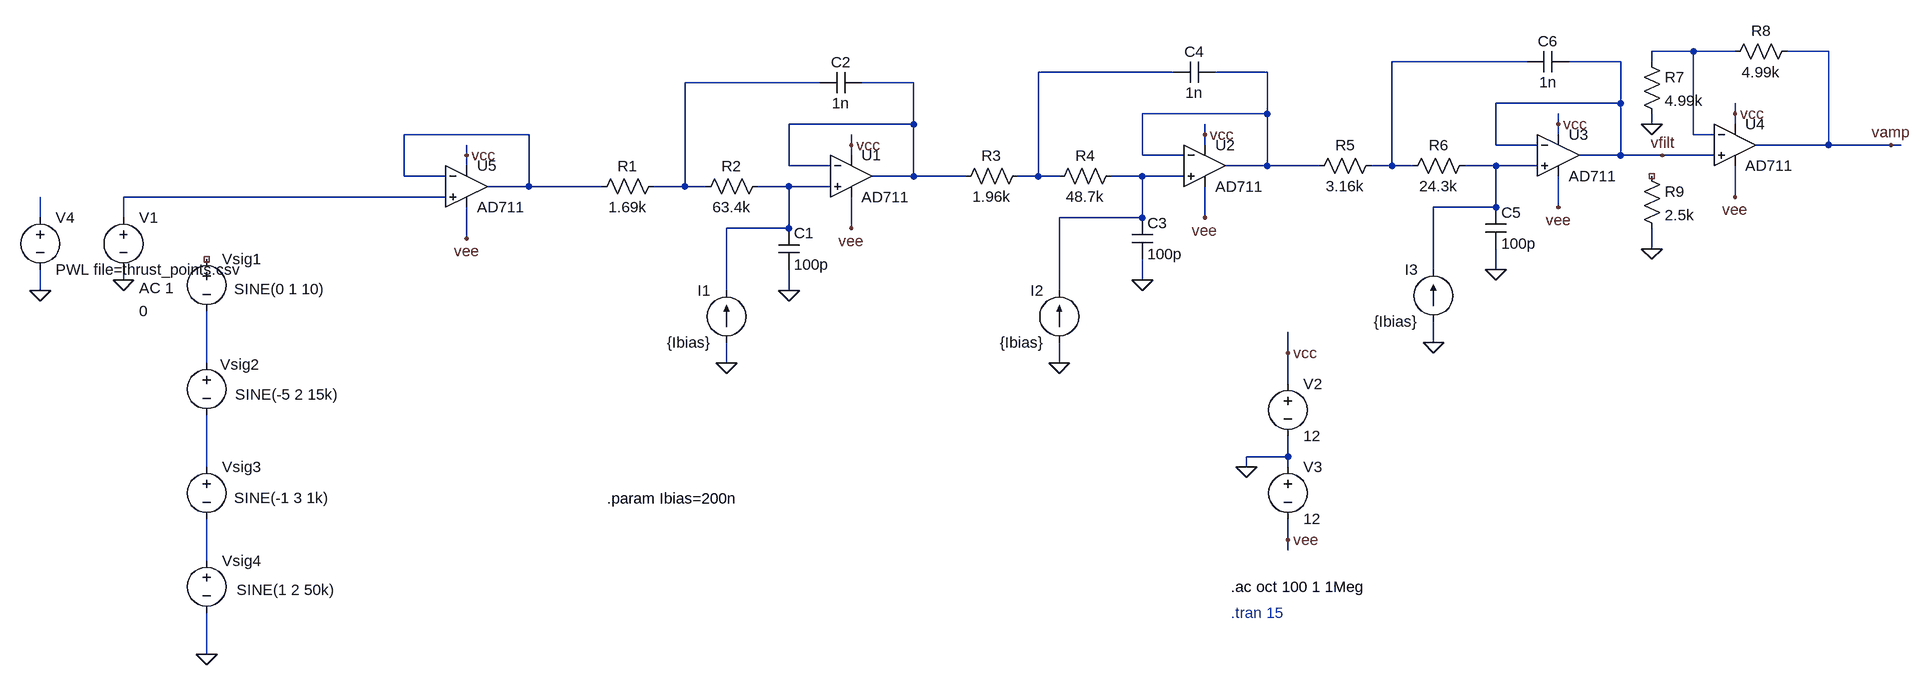
[diagram p0: schematic Anti-Aliasing Filter 30kHz 6th order Bessel.asc]
Anti-Aliasing Filter 30kHz 6th order Bessel.asc, the LTspice schematic file:
Version 4
SHEET 1 2240 744
WIRE 1872 -224 1808 -224
WIRE 1936 -224 1872 -224
WIRE 2080 -224 2016 -224
WIRE 1616 -208 1408 -208
WIRE 1760 -208 1680 -208
WIRE 1808 -208 1808 -224
WIRE 1072 -192 864 -192
WIRE 1216 -192 1136 -192
WIRE 528 -176 320 -176
WIRE 672 -176 592 -176
WIRE 1760 -144 1760 -208
WIRE 1760 -144 1568 -144
WIRE 1216 -128 1216 -192
WIRE 1216 -128 1024 -128
WIRE 1936 -128 1936 -144
WIRE 672 -112 672 -176
WIRE 672 -112 480 -112
WIRE 1664 -112 1664 -128
WIRE 1808 -112 1808 -128
WIRE 1936 -112 1936 -128
WIRE 80 -96 -112 -96
WIRE 1120 -96 1120 -112
WIRE 1664 -96 1664 -112
WIRE 1872 -96 1872 -224
WIRE 1904 -96 1872 -96
WIRE 576 -80 576 -96
WIRE 1120 -80 1120 -96
WIRE 1568 -80 1568 -144
WIRE 1632 -80 1568 -80
WIRE 2080 -80 2080 -224
WIRE 2080 -80 1968 -80
WIRE 2176 -80 2080 -80
WIRE 2192 -80 2176 -80
WIRE -16 -64 -16 -80
WIRE 576 -64 576 -80
WIRE 1024 -64 1024 -128
WIRE 1088 -64 1024 -64
WIRE 1760 -64 1760 -144
WIRE 1760 -64 1696 -64
WIRE 1824 -64 1760 -64
WIRE 1904 -64 1824 -64
WIRE -16 -48 -16 -64
WIRE 480 -48 480 -112
WIRE 544 -48 480 -48
WIRE 1216 -48 1216 -128
WIRE 1216 -48 1152 -48
WIRE 1296 -48 1216 -48
WIRE 1408 -48 1408 -208
WIRE 1408 -48 1376 -48
WIRE 1440 -48 1408 -48
WIRE 1568 -48 1520 -48
WIRE 1632 -48 1568 -48
WIRE -112 -32 -112 -96
WIRE -48 -32 -112 -32
WIRE 672 -32 672 -112
WIRE 672 -32 608 -32
WIRE 752 -32 672 -32
WIRE 864 -32 864 -192
WIRE 864 -32 832 -32
WIRE 896 -32 864 -32
WIRE 1024 -32 976 -32
WIRE 1088 -32 1024 -32
WIRE 80 -16 80 -96
WIRE 80 -16 16 -16
WIRE 192 -16 80 -16
WIRE 320 -16 320 -176
WIRE 320 -16 272 -16
WIRE 352 -16 320 -16
WIRE 480 -16 432 -16
WIRE 544 -16 480 -16
WIRE -48 0 -544 0
WIRE 1936 0 1936 -48
WIRE 1568 16 1568 -48
WIRE 1568 16 1472 16
WIRE 1664 16 1664 -32
WIRE -672 32 -672 0
WIRE -544 32 -544 0
WIRE 1024 32 1024 -32
WIRE 1024 32 896 32
WIRE 1120 32 1120 -16
WIRE 480 48 480 -16
WIRE 480 48 384 48
WIRE 576 48 576 0
WIRE -16 64 -16 16
WIRE 1808 80 1808 48
WIRE 1472 112 1472 16
WIRE 1568 112 1568 80
WIRE -544 128 -544 112
WIRE 1024 128 1024 96
WIRE -672 144 -672 112
WIRE 384 144 384 48
WIRE 480 144 480 112
WIRE 896 144 896 32
WIRE 1472 224 1472 192
WIRE 1248 240 1248 208
WIRE -416 256 -416 176
WIRE 384 256 384 224
WIRE 896 256 896 224
WIRE 1248 288 1248 240
WIRE 1248 400 1248 368
WIRE 1248 400 1184 400
WIRE -416 416 -416 336
WIRE 1184 416 1184 400
WIRE 1248 416 1248 400
WIRE 1248 528 1248 496
WIRE 1248 544 1248 528
WIRE -416 560 -416 496
WIRE -416 704 -416 640
FLAG -544 128 0
FLAG 480 144 0
FLAG 576 -80 vcc
FLAG 576 48 vee
FLAG 1184 416 0
FLAG 1248 240 vcc
FLAG 1248 528 vee
FLAG 1024 128 0
FLAG 1120 -96 vcc
FLAG 1120 32 vee
FLAG 1568 112 0
FLAG 1664 -112 vcc
FLAG 1664 16 vee
FLAG 1824 -64 vfilt
FLAG 1936 -128 vcc
FLAG 1936 0 vee
FLAG 1808 -112 0
FLAG 2176 -80 vamp
FLAG -416 704 0
FLAG 1808 80 0
FLAG -672 144 0
FLAG -16 -64 vcc
FLAG -16 64 vee
FLAG 384 256 0
FLAG 896 256 0
FLAG 1472 224 0
SYMBOL voltage -544 16 R0
WINDOW 123 24 124 Left 2
WINDOW 39 0 0 Left 0
WINDOW 3 24 160 Left 2
SYMATTR Value2 AC 1
SYMATTR Value 0
SYMATTR InstName V1
SYMBOL res 288 -32 R90
WINDOW 0 0 56 VBottom 2
WINDOW 3 32 56 VTop 2
SYMATTR InstName R1
SYMATTR Value 1.69k
SYMBOL res 448 -32 R90
WINDOW 0 0 56 VBottom 2
WINDOW 3 32 56 VTop 2
SYMATTR InstName R2
SYMATTR Value 63.4k
SYMBOL cap 464 48 R0
SYMATTR InstName C1
SYMATTR Value 100p
SYMBOL cap 592 -192 R90
WINDOW 0 0 32 VBottom 2
WINDOW 3 32 32 VTop 2
SYMATTR InstName C2
SYMATTR Value 1n
SYMBOL OpAmps\\AD711 576 -96 R0
SYMATTR InstName U1
SYMBOL voltage 1248 272 R0
WINDOW 123 0 0 Left 0
WINDOW 39 0 0 Left 0
SYMATTR InstName V2
SYMATTR Value 12
SYMBOL voltage 1248 400 R0
WINDOW 123 0 0 Left 0
WINDOW 39 0 0 Left 0
SYMATTR InstName V3
SYMATTR Value 12
SYMBOL res 848 -48 R90
WINDOW 0 0 56 VBottom 2
WINDOW 3 32 56 VTop 2
SYMATTR InstName R3
SYMATTR Value 1.96k
SYMBOL res 992 -48 R90
WINDOW 0 0 56 VBottom 2
WINDOW 3 32 56 VTop 2
SYMATTR InstName R4
SYMATTR Value 48.7k
SYMBOL cap 1008 32 R0
SYMATTR InstName C3
SYMATTR Value 100p
SYMBOL cap 1136 -208 R90
WINDOW 0 0 32 VBottom 2
WINDOW 3 32 32 VTop 2
SYMATTR InstName C4
SYMATTR Value 1n
SYMBOL OpAmps\\AD711 1120 -112 R0
SYMATTR InstName U2
SYMBOL res 1392 -64 R90
WINDOW 0 0 56 VBottom 2
WINDOW 3 32 56 VTop 2
SYMATTR InstName R5
SYMATTR Value 3.16k
SYMBOL res 1536 -64 R90
WINDOW 0 0 56 VBottom 2
WINDOW 3 32 56 VTop 2
SYMATTR InstName R6
SYMATTR Value 24.3k
SYMBOL cap 1552 16 R0
SYMATTR InstName C5
SYMATTR Value 100p
SYMBOL cap 1680 -224 R90
WINDOW 0 0 32 VBottom 2
WINDOW 3 32 32 VTop 2
SYMATTR InstName C6
SYMATTR Value 1n
SYMBOL OpAmps\\AD711 1664 -128 R0
SYMATTR InstName U3
SYMBOL OpAmps\\AD711 1936 -144 R0
SYMATTR InstName U4
SYMBOL res 1792 -224 R0
SYMATTR InstName R7
SYMATTR Value 4.99k
SYMBOL res 2032 -240 R90
WINDOW 0 0 56 VBottom 2
WINDOW 3 32 56 VTop 2
SYMATTR InstName R8
SYMATTR Value 4.99k
SYMBOL voltage -416 80 R0
WINDOW 3 42 62 Left 2
WINDOW 123 24 124 Left 2
WINDOW 39 0 0 Left 0
SYMATTR Value SINE(0 1 10)
SYMATTR InstName Vsig1
SYMBOL voltage -416 240 R0
WINDOW 3 44 64 Left 2
WINDOW 123 24 124 Left 2
WINDOW 39 0 0 Left 0
WINDOW 0 21 18 Left 2
SYMATTR Value SINE(-5 2 15k)
SYMATTR InstName Vsig2
SYMBOL voltage -416 400 R0
WINDOW 3 42 63 Left 2
WINDOW 123 24 124 Left 2
WINDOW 39 0 0 Left 0
SYMATTR Value SINE(-1 3 1k)
SYMATTR InstName Vsig3
SYMBOL voltage -416 544 R0
WINDOW 3 46 61 Left 2
WINDOW 123 24 124 Left 2
WINDOW 39 0 0 Left 0
SYMATTR Value SINE(1 2 50k)
SYMATTR InstName Vsig4
SYMBOL res 1792 -48 R0
SYMATTR InstName R9
SYMATTR Value 2.5k
SYMBOL voltage -672 16 R0
WINDOW 123 0 0 Left 0
WINDOW 39 0 0 Left 0
SYMATTR InstName V4
SYMATTR Value PWL file=thrust_points.csv
SYMBOL OpAmps\\AD711 -16 -80 R0
SYMATTR InstName U5
SYMBOL current 384 224 R180
WINDOW 0 24 80 Left 2
WINDOW 3 24 0 Left 2
WINDOW 123 0 0 Left 0
WINDOW 39 0 0 Left 0
SYMATTR InstName I1
SYMATTR Value {Ibias}
SYMBOL current 896 224 R180
WINDOW 0 24 80 Left 2
WINDOW 3 24 0 Left 2
WINDOW 123 0 0 Left 0
WINDOW 39 0 0 Left 0
SYMATTR InstName I2
SYMATTR Value {Ibias}
SYMBOL current 1472 192 R180
WINDOW 0 24 80 Left 2
WINDOW 3 24 0 Left 2
WINDOW 123 0 0 Left 0
WINDOW 39 0 0 Left 0
SYMATTR InstName I3
SYMATTR Value {Ibias}
TEXT 1160 600 Left 2 !.ac oct 100 1 1Meg
TEXT 1160 640 Left 2 ;.tran 15
TEXT 200 464 Left 2 !.param Ibias=200n

The netlist it stands for:
* Anti-Aliasing Filter 30kHz 6th order Bessel.asc
V1 N011 0 0 AC 1
R1 N005 N007 1.69k
R2 N010 N005 63.4k
C1 N010 0 100p
C2 N006 N005 1n
XU1 N010 N006 vcc vee N006 AD712  ; AD711, pins In+ In- V+ V- OUT
V2 vcc 0 12
V3 0 vee 12
R3 N003 N006 1.96k
R4 N009 N003 48.7k
C3 N009 0 100p
C4 N004 N003 1n
XU2 N009 N004 vcc vee N004 AD712  ; AD711, pins In+ In- V+ V- OUT
R5 N002 N004 3.16k
R6 N008 N002 24.3k
C5 N008 0 100p
C6 vfilt N002 1n
XU3 N008 vfilt vcc vee vfilt AD712  ; AD711, pins In+ In- V+ V- OUT
XU4 vfilt N001 vcc vee vamp AD712  ; AD711, pins In+ In- V+ V- OUT
R7 N001 0 4.99k
R8 vamp N001 4.99k
Vsig1 NC_01 N013 SINE(0 1 10)
Vsig2 N013 N014 SINE(-5 2 15k)
Vsig3 N014 N015 SINE(-1 3 1k)
Vsig4 N015 0 SINE(1 2 50k)
R9 NC_02 0 2.5k
V4 N012 0 PWL file=thrust_points.csv
XU5 N011 N007 vcc vee N007 AD712  ; AD711, pins In+ In- V+ V- OUT
I1 0 N010 {Ibias}
I2 0 N009 {Ibias}
I3 0 N008 {Ibias}
.ac oct 100 1 1Meg
* .tran 15
.param Ibias=200n
.lib ADI1.lib
.backanno
.end